# Altium schematic sheet [6] Jetson Nano P2.SchDoc: ARS Camera REV01 Jetson Nano P2
size A3; DrawnBy: Manh Ngo Van; Engineer: Manh Ngo Van; Organization: Altium Limited; Address1: L3, 12a Rodborough Rd; Address2: Frenchs Forest; Address3: NSW; Address4: Australia 2086; DocumentNumber: 6; Revision: 1.0; SheetNumber: 6; SheetTotal: 16
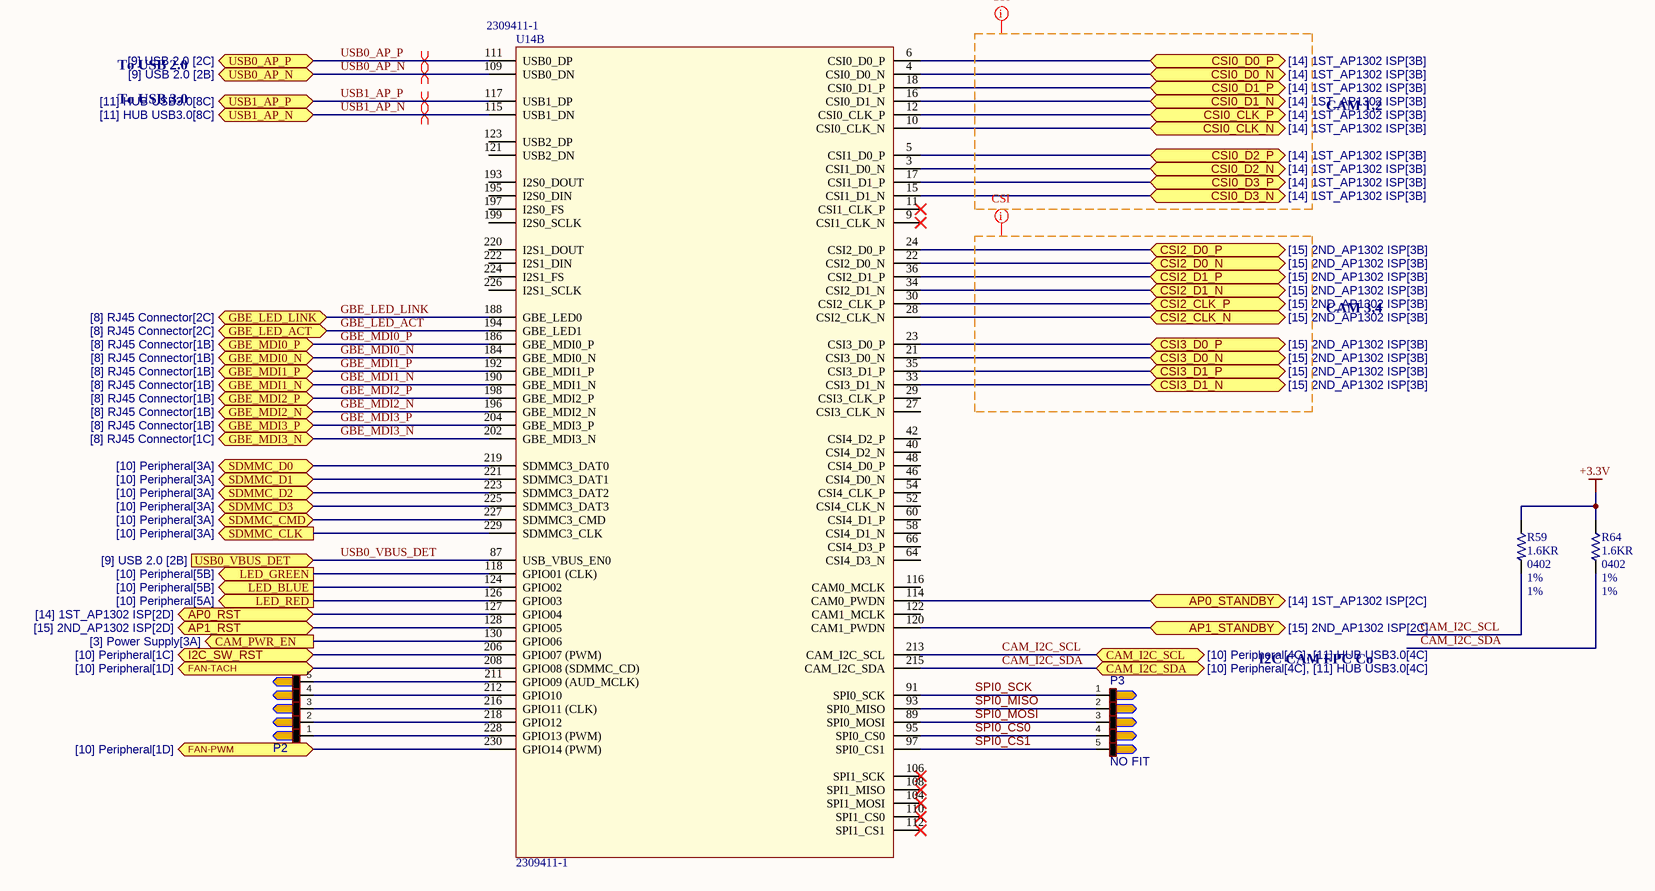
[diagram p0: [6] Jetson Nano P2.SchDoc]

## Parts
P2  61300511021  [61300511021]  (value not drawn)
P3  NO FIT  [61300511021_NO_3D]
R59  1.6KR  Case Code (Imperial): 0402  Tolerance: 1%  [R0402M]
R64  1.6KR  Case Code (Imperial): 0402  Tolerance: 1%  [R0402M]
U14  2309411-1  [2309411-1]  (part B of 3)

## Ports
AP0_RST (bidir, see [14] 1ST_AP1302 ISP[2D]), AP0_STANDBY (bidir, see [14] 1ST_AP1302 ISP[2C]), AP1_RST (bidir, see [15] 2ND_AP1302 ISP[2D]), AP1_STANDBY (bidir, see [15] 2ND_AP1302 ISP[2C]), CAM_I2C_SCL (bidir, see [10] Peripheral[4C], [11] HUB USB3.0[4C]), CAM_I2C_SDA (bidir, see [10] Peripheral[4C], [11] HUB USB3.0[4C]), CAM_PWR_EN (out, see [3] Power Supply[3A]), CSI0_CLK_N (bidir, see [14] 1ST_AP1302 ISP[3B]), CSI0_CLK_P (bidir, see [14] 1ST_AP1302 ISP[3B]), CSI0_D0_N (bidir, see [14] 1ST_AP1302 ISP[3B]), CSI0_D0_P (bidir, see [14] 1ST_AP1302 ISP[3B]), CSI0_D1_N (bidir, see [14] 1ST_AP1302 ISP[3B]), CSI0_D1_P (bidir, see [14] 1ST_AP1302 ISP[3B]), CSI0_D2_N (bidir, see [14] 1ST_AP1302 ISP[3B]), CSI0_D2_P (bidir, see [14] 1ST_AP1302 ISP[3B]), CSI0_D3_N (bidir, see [14] 1ST_AP1302 ISP[3B]), CSI0_D3_P (bidir, see [14] 1ST_AP1302 ISP[3B]), CSI2_CLK_N (bidir, see [15] 2ND_AP1302 ISP[3B]), CSI2_CLK_P (bidir, see [15] 2ND_AP1302 ISP[3B]), CSI2_D0_N (bidir, see [15] 2ND_AP1302 ISP[3B]), CSI2_D0_P (bidir, see [15] 2ND_AP1302 ISP[3B]), CSI2_D1_N (bidir, see [15] 2ND_AP1302 ISP[3B]), CSI2_D1_P (bidir, see [15] 2ND_AP1302 ISP[3B]), CSI3_D0_N (bidir, see [15] 2ND_AP1302 ISP[3B]), CSI3_D0_P (bidir, see [15] 2ND_AP1302 ISP[3B]), CSI3_D1_N (bidir, see [15] 2ND_AP1302 ISP[3B]), CSI3_D1_P (bidir, see [15] 2ND_AP1302 ISP[3B]), FAN-PWM (bidir, see [10] Peripheral[1D]), FAN-TACH (bidir, see [10] Peripheral[1D]), GBE_LED_ACT (bidir, see [8] RJ45 Connector[2C]), GBE_LED_LINK (bidir, see [8] RJ45 Connector[2C]), GBE_MDI0_N (bidir, see [8] RJ45 Connector[1B]), GBE_MDI0_P (bidir, see [8] RJ45 Connector[1B]), GBE_MDI1_N (bidir, see [8] RJ45 Connector[1B]), GBE_MDI1_P (bidir, see [8] RJ45 Connector[1B]), GBE_MDI2_N (bidir, see [8] RJ45 Connector[1B]), GBE_MDI2_P (bidir, see [8] RJ45 Connector[1B]), GBE_MDI3_N (bidir, see [8] RJ45 Connector[1C]), GBE_MDI3_P (bidir, see [8] RJ45 Connector[1B]), I2C_SW_RST (bidir, see [10] Peripheral[1C]), LED_BLUE (out, see [10] Peripheral[5B]), LED_GREEN (out, see [10] Peripheral[5B]), LED_RED (out, see [10] Peripheral[5A]), SDMMC_CLK (out, see [10] Peripheral[3A]), SDMMC_CMD (bidir, see [10] Peripheral[3A]), SDMMC_D0 (bidir, see [10] Peripheral[3A]), SDMMC_D1 (bidir, see [10] Peripheral[3A]), SDMMC_D2 (bidir, see [10] Peripheral[3A]), SDMMC_D3 (bidir, see [10] Peripheral[3A]), USB0_AP_N (bidir, see [9] USB 2.0 [2B]), USB0_AP_P (bidir, see [9] USB 2.0 [2C]), USB0_VBUS_DET (in, see [9] USB 2.0 [2B]), USB1_AP_N (bidir, see [11] HUB USB3.0[8C]), USB1_AP_P (bidir, see [11] HUB USB3.0[8C])

## Nets
+3.3V: R59.2 R64.2
AP0_RST: U14.127(GPIO04) ; port AP0_RST
AP0_STANDBY: U14.114(CAM0_PWDN) ; port AP0_STANDBY
AP1_RST: U14.128(GPIO05) ; port AP1_RST
AP1_STANDBY: U14.120(CAM1_PWDN) ; port AP1_STANDBY
CAM_I2C_SCL: R59.1 U14.213(CAM_I2C_SCL) ; port CAM_I2C_SCL
CAM_I2C_SDA: R64.1 U14.215(CAM_I2C_SDA) ; port CAM_I2C_SDA
CAM_PWR_EN: U14.130(GPIO06) ; port CAM_PWR_EN
CSI0_CLK_N: U14.10(CSI0_CLK_N) ; port CSI0_CLK_N
CSI0_CLK_P: U14.12(CSI0_CLK_P) ; port CSI0_CLK_P
CSI0_D0_N: U14.4(CSI0_D0_N) ; port CSI0_D0_N
CSI0_D0_P: U14.6(CSI0_D0_P) ; port CSI0_D0_P
CSI0_D1_N: U14.16(CSI0_D1_N) ; port CSI0_D1_N
CSI0_D1_P: U14.18(CSI0_D1_P) ; port CSI0_D1_P
CSI0_D2_N: U14.3(CSI1_D0_N) ; port CSI0_D2_N
CSI0_D2_P: U14.5(CSI1_D0_P) ; port CSI0_D2_P
CSI0_D3_N: U14.15(CSI1_D1_N) ; port CSI0_D3_N
CSI0_D3_P: U14.17(CSI1_D1_P) ; port CSI0_D3_P
CSI2_CLK_N: U14.28(CSI2_CLK_N) ; port CSI2_CLK_N
CSI2_CLK_P: U14.30(CSI2_CLK_P) ; port CSI2_CLK_P
CSI2_D0_N: U14.22(CSI2_D0_N) ; port CSI2_D0_N
CSI2_D0_P: U14.24(CSI2_D0_P) ; port CSI2_D0_P
CSI2_D1_N: U14.34(CSI2_D1_N) ; port CSI2_D1_N
CSI2_D1_P: U14.36(CSI2_D1_P) ; port CSI2_D1_P
CSI3_D0_N: U14.21(CSI3_D0_N) ; port CSI3_D0_N
CSI3_D0_P: U14.23(CSI3_D0_P) ; port CSI3_D0_P
CSI3_D1_N: U14.33(CSI3_D1_N) ; port CSI3_D1_N
CSI3_D1_P: U14.35(CSI3_D1_P) ; port CSI3_D1_P
FAN-PWM: U14.230(GPIO14_(PWM)) ; port FAN-PWM
FAN-TACH: U14.208(GPIO08_(SDMMC_CD)) ; port FAN-TACH
GBE_LED_ACT: U14.194(GBE_LED1) ; port GBE_LED_ACT
GBE_LED_LINK: U14.188(GBE_LED0) ; port GBE_LED_LINK
GBE_MDI0_N: U14.184(GBE_MDI0_N) ; port GBE_MDI0_N
GBE_MDI0_P: U14.186(GBE_MDI0_P) ; port GBE_MDI0_P
GBE_MDI1_N: U14.190(GBE_MDI1_N) ; port GBE_MDI1_N
GBE_MDI1_P: U14.192(GBE_MDI1_P) ; port GBE_MDI1_P
GBE_MDI2_N: U14.196(GBE_MDI2_N) ; port GBE_MDI2_N
GBE_MDI2_P: U14.198(GBE_MDI2_P) ; port GBE_MDI2_P
GBE_MDI3_N: U14.202(GBE_MDI3_N) ; port GBE_MDI3_N
GBE_MDI3_P: U14.204(GBE_MDI3_P) ; port GBE_MDI3_P
I2C_SW_RST: U14.206(GPIO07_(PWM)) ; port I2C_SW_RST
LED_BLUE: U14.124(GPIO02) ; port LED_BLUE
LED_GREEN: U14.118(GPIO01_(CLK)) ; port LED_GREEN
LED_RED: U14.126(GPIO03) ; port LED_RED
SDMMC_CLK: U14.229(SDMMC3_CLK) ; port SDMMC_CLK
SDMMC_CMD: U14.227(SDMMC3_CMD) ; port SDMMC_CMD
SDMMC_D0: U14.219(SDMMC3_DAT0) ; port SDMMC_D0
SDMMC_D1: U14.221(SDMMC3_DAT1) ; port SDMMC_D1
SDMMC_D2: U14.223(SDMMC3_DAT2) ; port SDMMC_D2
SDMMC_D3: U14.225(SDMMC3_DAT3) ; port SDMMC_D3
SPI0_CS0: P3.4 U14.95(SPI0_CS0)
SPI0_CS1: P3.5 U14.97(SPI0_CS1)
SPI0_MISO: P3.2 U14.93(SPI0_MISO)
SPI0_MOSI: P3.3 U14.89(SPI0_MOSI)
SPI0_SCK: P3.1 U14.91(SPI0_SCK)
USB0_AP_N: U14.109(USB0_DN) ; port USB0_AP_N
USB0_AP_P: U14.111(USB0_DP) ; port USB0_AP_P
USB0_VBUS_DET: U14.87(USB_VBUS_EN0) ; port USB0_VBUS_DET
USB1_AP_N: U14.115(USB1_DN) ; port USB1_AP_N
USB1_AP_P: U14.117(USB1_DP) ; port USB1_AP_P
NetP2_1: P2.1 U14.228(GPIO13_(PWM))
NetP2_2: P2.2 U14.218(GPIO12)
NetP2_3: P2.3 U14.216(GPIO11_(CLK))
NetP2_4: P2.4 U14.212(GPIO10)
NetP2_5: P2.5 U14.211(GPIO09_(AUD_MCLK))

Not connected (* = marked no-connect by the designer): U14 9(CSI1_CLK_N)* 11(CSI1_CLK_P)* 27(CSI3_CLK_N) 29(CSI3_CLK_P) 40(CSI4_D2_N) 42(CSI4_D2_P) 46(CSI4_D0_N) 48(CSI4_D0_P) 52(CSI4_CLK_N) 54(CSI4_CLK_P) 58(CSI4_D1_N) 60(CSI4_D1_P) 64(CSI4_D3_N) 66(CSI4_D3_P) 104(SPI1_MOSI)* 106(SPI1_SCK)* 108(SPI1_MISO)* 110(SPI1_CS0)* 112(SPI1_CS1)* 116(CAM0_MCLK) 121(USB2_DN) 122(CAM1_MCLK) 123(USB2_DP) 193(I2S0_DOUT) 195(I2S0_DIN) 197(I2S0_FS) 199(I2S0_SCLK) 220(I2S1_DOUT) 222(I2S1_DIN) 224(I2S1_FS) 226(I2S1_SCLK)

## Layout directives
differential pair; differential pair class DIFF90; net class DIFF90: USB0_AP_N, USB0_AP_P, USB1_AP_N, USB1_AP_P
net class CSI: (no net found under the mark)

## Notes on the sheet
- To USB 2.0
- To USB 3.0
- CAM 1,2
- CAM 3,4
- I2C CAM FPC Co
- Title:
- Size
- Document Number:
- Engineer:
- Drawn By:
- Rev:
- Date:
- A3
- Sheet
- of

## Library data of the parts
P2 = WE-CN-1P-M-R5: CONN HEADER VERT 5POS 2.54MM; Manufacturer: Würth Elektronik GmbH; Manufacturer Part Number: 61300511021; Supplier 1: RSComponents; Supplier Part Number 1: 8281667P
P3 = WE-CN-1P-M-R5: CONN HEADER R/A 5POS 2.54MM; Manufacturer Part Number: 61300511021; Manufacturer: Würth Elektronik GmbH; Supplier 1: RSComponents; Supplier Part Number 1: 8281667P
R59 R64 = RES_SMD: RES SMD 1.6K OHM 1% 1/16W 0402; Manufacturer 1: Yageo; Manufacturer Part Number 1: RC0402FR-071K6L; Mouting Technology: SMT; Temperature Coefficient: 100ppm/°C; Power Rating: 63mW; Voltage Rating: 50V; Pin: 2; Supplier 1: Digi-Key; Supplier Part Number 1: YAG3045CT-ND; Stock 1: 68844; Pricing 1: 1=0.10000, 10=0.01600, 100=0.00660, 1000=0.00299, 2500=0.00259, 5000=0.00214 (USD); RoHS: Yes; Case/Package: 0402; Contact Plating: Tin,Matte; Case Code (Metric): 1005; Size Code: 0402; Min Operating Temperature: -55°C; Max Operating Temperature: 155°C; Resistance: 1.6kR; Resistor Type: Thick Film; Packaging: Tape and Reel; Termination: SMD/SMT; Number of Terminations: 2; Max Power Dissipation: 63mW; Voltage Rating (DC): 50V; Features: Moisture Resistant; Series: RC; Construction: Rectangular; Resistance Tolerance: 1%; Length: 1mm; Width: 0.5mm; Height: 0.016inch; Depth: 0.5mm; REACH SVHC: Unknown; Military Standard: Not; Lead Free: Lead Free; RoHS Compliant: Yes; ComponentLink1URL: https://datasheet.ciiva.com/8895/pyu-rc0402-51-rohs-l-6-8895221.pdf?src-supplier=Avnet; ComponentLink1Description: https://datasheet.ciiva.com/8895/pyu-rc0402-51-rohs-l-6-8895221.pdf?src-supplier=Avnet; ComponentLink2URL: https://datasheet.ciiva.com/7849/1018594-7849865.pdf?src-supplier=Element14; ComponentLink2Description: https://datasheet.ciiva.com/7849/1018594-7849865.pdf?src-supplier=Element14; ComponentLink3URL: https://datasheet.ciiva.com/7849/1018594-7849866.pdf?src-supplier=Element14; ComponentLink3Description: https://datasheet.ciiva.com/7849/1018594-7849866.pdf?src-supplier=Element14; ComponentLink4URL: https://datasheet.ciiva.com/28416/pyu-rc0402-51-rohs-l-6-28416730.pdf?src-supplier=Avnet+Europe; ComponentLink4Description: https://datasheet.ciiva.com/28416/pyu-rc0402-51-rohs-l-6-28416730.pdf?src-supplier=Avnet+Europe; ComponentLink5URL: https://datasheet.ciiva.com/15189/getdatasheetpartid-329238-15189373.pdf?src-supplier=Verical; ComponentLink5Description: https://datasheet.ciiva.com/15189/getdatasheetpartid-329238-15189373.pdf?src-supplier=Verical
U14 = Jetson Nano SODIMM: DDR4 SODIMM 260P 8.0H STD; Manufacturer: TE Connectivity; Contact Current Rating: 500mA; Circuit Application: Power; Connector System: Cable-to-Board; Number of Positions: 260; PCB Mount Retention: With; Sealable: No (Without); Row Spacing: 0.322inch; Pitch: 2.1mm; Stack Height: 0.157inch; Manufacturer Part Number: 2309411-1; RoHS: Yes; Category: Memory Connectors; Stock 1: 7189; Pricing 1: 1=1.40000, 10=1.22700, 25=1.15520, 50=1.10700, 100=1.05890 (USD); Mount: Surface Mount; Contact Plating: Gold; Contact Material: Copper Alloy; Housing Color: Black; Housing Material: Thermoplastic; Min Operating Temperature: -67°C; Max Operating Temperature: 185°C; Number of Rows: 2; Packaging: Tape and Reel; Package Quantity: 900; Flammability Rating: UL94 V-0; RoHS Compliant: Yes; ComponentLink1URL: https://www.te.com/commerce/DocumentDelivery/DDEController?Action=srchrtrv&amp;DocNm=2309407&amp;DocType=Customer+Drawing&amp;DocLang=English&src-supplier=Digi-Key; ComponentLink1Description: https://www.te.com/commerce/DocumentDelivery/DDEController?Action=srchrtrv&amp;DocNm=2309407&amp;DocType=Customer+Drawing&amp;DocLang=English&src-supplier=Digi-Key; ComponentLink2URL: https://www.te.com/commerce/DocumentDelivery/DDEController?Action=srchrtrv&DocNm=2309407&DocType=Customer+Drawing&DocLang=English&src-supplier=Digi-Key; ComponentLink2Description: https://www.te.com/commerce/DocumentDelivery/DDEController?Action=srchrtrv&DocNm=2309407&DocType=Customer+Drawing&DocLang=English&src-supplier=Digi-Key; Supplier 1: Arrow Electronics; Supplier Part Number 1: 2309411-1